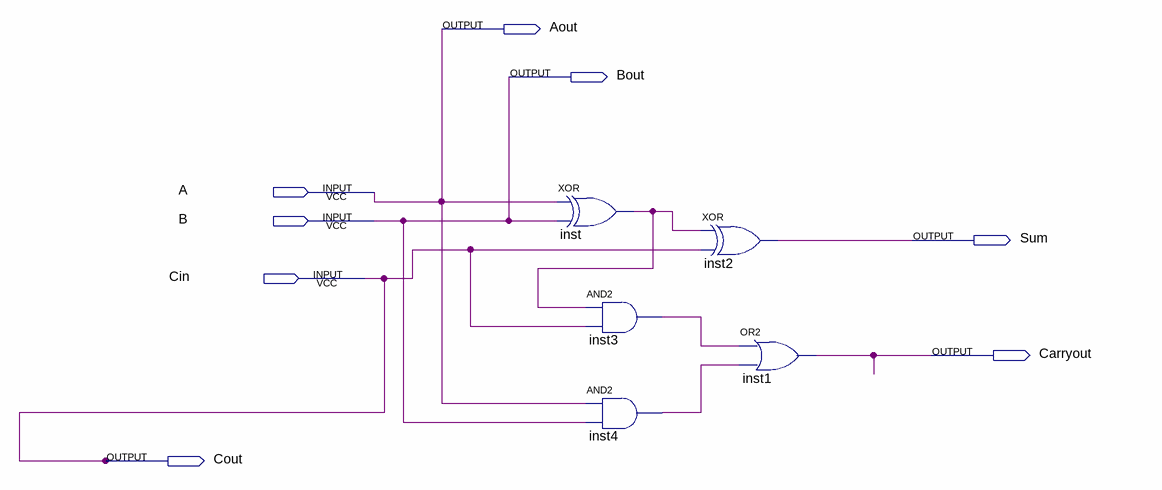
[diagram p0: schematic sheet]
// Quartus schematic Lab4DE2.bdf as structural Verilog: 5 symbols, 8 pins
module Lab4DE2 (
  input  A,
  input  B,
  input  Cin,
  output Aout,
  output Bout,
  output Sum,
  output Carryout,
  output Cout
);

  wire inst3_out, inst4_out, inst_out;

  xor inst (inst_out, A, B);
  and inst3 (inst3_out, inst_out, Cin);
  and inst4 (inst4_out, A, B);
  xor inst2 (Sum, inst_out, Cin);
  or inst1 (Carryout, inst3_out, inst4_out);

  assign Aout = A;
  assign Bout = B;
  assign Cout = Cin;
endmodule
